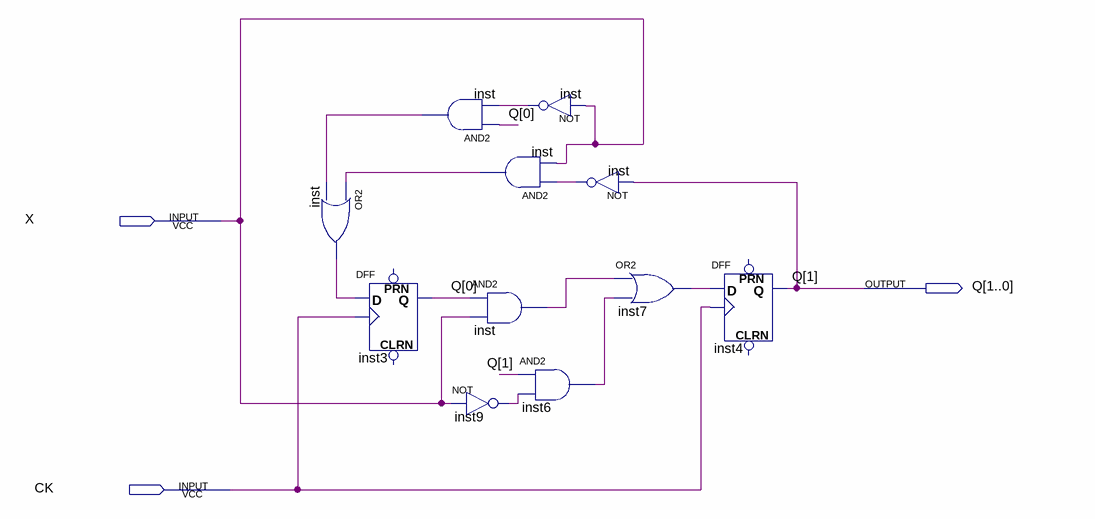
[diagram p0: schematic sheet]
// Quartus schematic DFF.bdf as structural Verilog: 11 symbols, 3 pins
module DFF (
  input  X,
  input  CK,
  output [1:0] Q
);

  wire inst6_out, inst7_out, inst9_out, inst_out, inst_out_2, inst_out_3, inst_out_4, inst_out_5, inst_out_6;

  or inst (inst_out_3, inst_out_4, inst_out_5);
  DFF inst3 (.CLK(CK), .D(inst_out_3), .Q(Q[0]));  // open: CLRN, PRN
  and inst_dup2 (inst_out_5, Q[0], inst_out_2);
  not inst9 (inst9_out, X);
  not inst_dup3 (inst_out_2, X);
  and inst_dup4 (inst_out_4, inst_out, X);
  and inst_dup5 (inst_out_6, Q[0], X);
  and inst6 (inst6_out, Q[1], inst9_out);
  not inst_dup6 (inst_out, Q[1]);
  or inst7 (inst7_out, inst_out_6, inst6_out);
  DFF inst4 (.CLK(CK), .D(inst7_out), .Q(Q[1]));  // open: CLRN, PRN
endmodule
